# Altium schematic sheet Overview.SchDoc
size A4; SheetNumber: 1; SheetTotal: 7
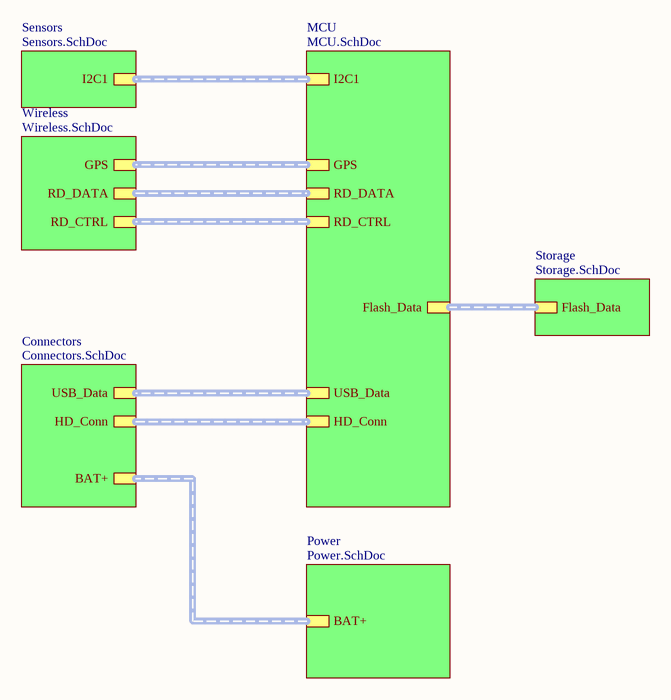
[diagram p0: Overview.SchDoc]

## Sub-sheets
Connectors = Connectors.SchDoc: USB_Data (harness USB_Data), BAT+, HD_Conn (harness HD_CONN)
MCU = MCU.SchDoc: I2C1 (harness I2C), USB_Data (harness USB_Data), RD_DATA (harness RD_DATA), RD_CTRL (harness RD_CTRL), GPS (harness GPS), Flash_Data (harness Flash_Data), HD_Conn (harness HD_CONN)
Power = Power.SchDoc: BAT+
Sensors = Sensors.SchDoc: I2C1 (harness I2C)
Storage = Storage.SchDoc: Flash_Data (harness Flash_Data)
Wireless = Wireless.SchDoc: GPS (harness GPS), RD_DATA (harness RD_DATA), RD_CTRL (harness RD_CTRL)

## Buses and harness runs
harness sheet Connectors/BAT+ = sheet Power/BAT+
harness sheet Connectors/HD_Conn = sheet MCU/HD_Conn
harness sheet Connectors/USB_Data = sheet MCU/USB_Data
harness sheet MCU/Flash_Data = sheet Storage/Flash_Data
harness sheet MCU/GPS = sheet Wireless/GPS
harness sheet MCU/I2C1 = sheet Sensors/I2C1
harness sheet MCU/RD_CTRL = sheet Wireless/RD_CTRL
harness sheet MCU/RD_DATA = sheet Wireless/RD_DATA